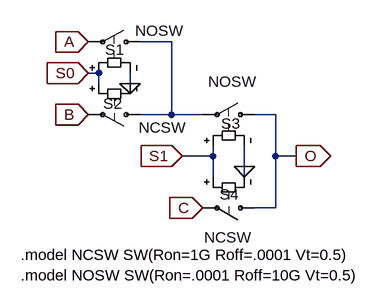
[diagram p0: schematic Mux3_1.asc]
Mux3_1.asc, the LTspice schematic file:
Version 4
SHEET 1 880 680
WIRE 144 48 96 48
WIRE 32 96 16 96
WIRE 32 112 32 96
WIRE 80 112 80 96
WIRE 144 160 144 48
WIRE 144 160 96 160
WIRE 192 160 144 160
WIRE 304 160 272 160
WIRE 208 224 208 208
WIRE 208 224 160 224
WIRE 304 224 304 160
WIRE 336 224 304 224
WIRE 256 240 256 208
WIRE 208 256 208 224
WIRE 256 256 256 240
WIRE 304 304 304 224
WIRE 304 304 272 304
FLAG 80 112 0
FLAG 256 240 0
FLAG 16 48 A
IOPIN 16 48 In
FLAG 16 160 B
IOPIN 16 160 In
FLAG 192 304 C
IOPIN 192 304 In
FLAG 16 96 S0
IOPIN 16 96 In
FLAG 160 224 S1
IOPIN 160 224 In
FLAG 336 224 O
IOPIN 336 224 Out
SYMBOL sw 112 48 M270
WINDOW 0 -12 70 VLeft 2
WINDOW 3 17 24 VLeft 2
SYMATTR InstName S1
SYMATTR Value NOSW
SYMBOL sw 112 160 R90
WINDOW 0 -17 44 VRight 2
WINDOW 3 20 -54 VRight 2
SYMATTR InstName S2
SYMATTR Value NCSW
SYMBOL sw 288 160 M270
WINDOW 0 -14 68 VLeft 2
WINDOW 3 51 88 VLeft 2
SYMATTR InstName S3
SYMATTR Value NOSW
SYMBOL sw 288 304 R90
WINDOW 0 -21 41 VRight 2
WINDOW 3 45 21 VRight 2
SYMATTR InstName S4
SYMATTR Value NCSW
TEXT -88 376 Left 2 !.model NCSW SW(Ron=1G Roff=.0001 Vt=0.5)
TEXT -88 408 Left 2 !.model NOSW SW(Ron=.0001 Roff=10G Vt=0.5)

The netlist it stands for:
* Mux3_1.asc
S1 N001 A S0 0 NOSW
S2 N001 B S0 0 NCSW
S3 O N001 S1 0 NOSW
S4 O C S1 0 NCSW
.model NCSW SW(Ron=1G Roff=.0001 Vt=0.5)
.model NOSW SW(Ron=.0001 Roff=10G Vt=0.5)
.backanno
.end